# Altium schematic sheet BreakoutBoard.SchDoc
size A; SheetNumber: 1; SheetTotal: 1
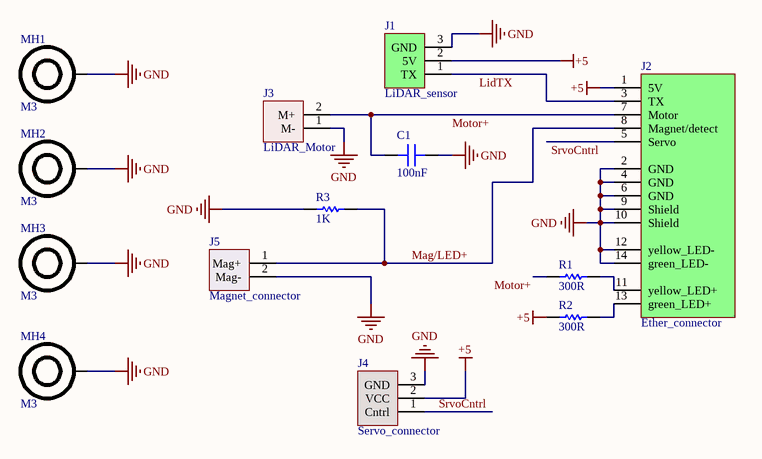
[diagram p0: BreakoutBoard.SchDoc]

## Parts
C1  100nF  [CAP 0603]
J1  LiDAR_sensor  [JST XH B3B-XH-A]
J2  Ether_connector  [MTJ88ARX1FSMLG]
J3  LiDAR_Motor  [JST XH B2B-XH-A]
J4  Servo_connector  [JST XH B3B-XH-A]
J5  Magnet_connector  [JST XH B2B-XH-A]
MH1  M3  [SCREW_M3.0]
MH2  M3  [SCREW_M3.0]
MH3  M3  [SCREW_M3.0]
MH4  M3  [SCREW_M3.0]
R1  300R  [RES 0603]
R2  300R  [RES 0603]
R3  1K  [RES 0603]

## Nets
+5: J1.2(5V) J2.1(5V) J4.2(VCC) R2.1
GND: C1.2 J1.3(GND) J2.2(GND) J2.4(GND) J2.6(GND) J2.9(Shield) J2.10(Shield) J2.12(yellow_LED-) J2.14(green_LED-) J3.1(M-) J4.3(GND) J5.2(Mag-) MH1.1 MH2.1 MH3.1 MH4.1 R3.1
LidTX: J1.1(TX) J2.3(TX)
Mag/LED+: J2.8(Magnet/detect) J5.1(Mag+) R3.2
Motor+: C1.1 J2.7(Motor) J3.2(M+) R1.1
SrvoCntrl: J2.5(Servo) J4.1(Cntrl)
NetJ2_11: J2.11(yellow_LED+) R1.2
NetJ2_13: J2.13(green_LED+) R2.2

## Library data of the parts
C1 = Capacitor: SMT Capacitor; Value: 100nF
MH1-MH4 = SCREW
R1-R3 = Res: Resistor; Ordered by: Subcon; Published: 8-Jun-2000; Revision: July-2002: Re-released for DXP Platform.; Publisher: Altium Limited
  R1 R2: Value: 300R
  R3: Value: 1K